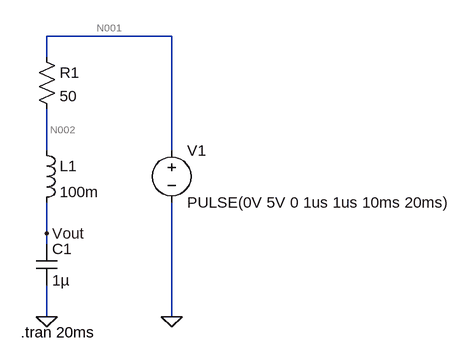
[diagram p0: schematic RLC.asc]
RLC.asc, the LTspice schematic file:
Version 4.1
SHEET 1 880 680
WIRE 224 -48 32 -48
WIRE 32 -16 32 -48
WIRE 32 128 32 64
WIRE 224 128 224 -48
WIRE 32 256 32 208
WIRE 32 272 32 256
WIRE 32 384 32 336
WIRE 224 384 224 208
FLAG 32 384 0
FLAG 224 384 0
FLAG 32 256 Vout
SYMBOL voltage 224 112 R0
WINDOW 123 0 0 Left 0
WINDOW 39 0 0 Left 0
SYMATTR InstName V1
SYMATTR Value PULSE(0V 5V 0 1us 1us 10ms 20ms)
SYMBOL res 16 -32 R0
SYMATTR InstName R1
SYMATTR Value 50
SYMBOL ind 16 112 R0
SYMATTR InstName L1
SYMATTR Value 100m
SYMBOL cap 16 272 R0
SYMATTR InstName C1
SYMATTR Value 1µ
TEXT -8 408 Left 2 !.tran 20ms

The netlist it stands for:
* RLC.asc
V1 N001 0 PULSE(0V 5V 0 1us 1us 10ms 20ms)
R1 N001 N002 50
L1 N002 Vout 100m
C1 Vout 0 1µ
.tran 20ms
.backanno
.end

* Results of the author's LTspice run, read from the files saved beside the schematic
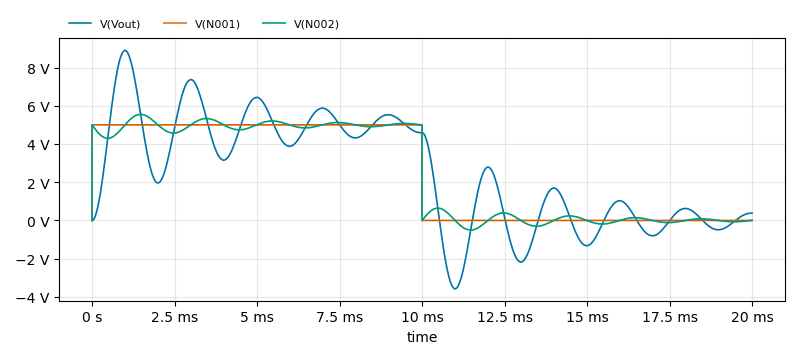
[diagram p1: Transient Analysis of RLC.asc, plotted from the saved traces]
* Transient Analysis, 1 run:
*   V(Vout): min -3.575 V, max 8.897 V, average 2.5 V, rms 3.838 V, last 379 mV
*   V(N001): min 0 V, max 5 V, average 2.5 V, rms 3.536 V, last 0 V
*   V(N002): min -502.4 mV, max 5.548 V, average 2.499 V, rms 3.528 V, last 5.05 mV